# EasyEDA Pro project esp8266开关.eprj, board 1.0
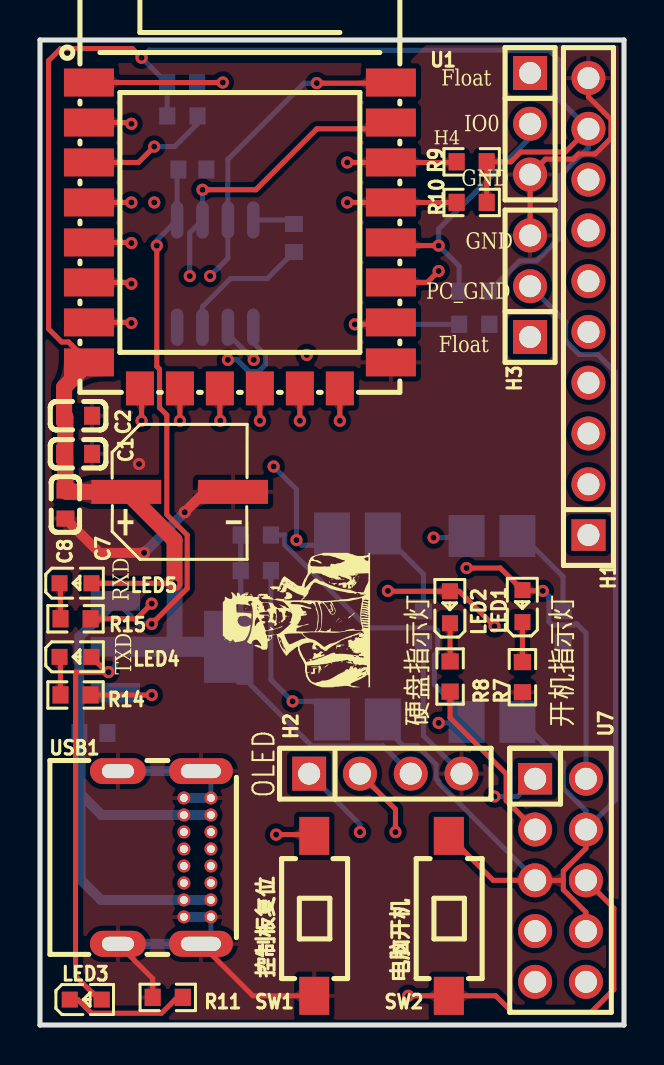
[diagram p4: board, top side]
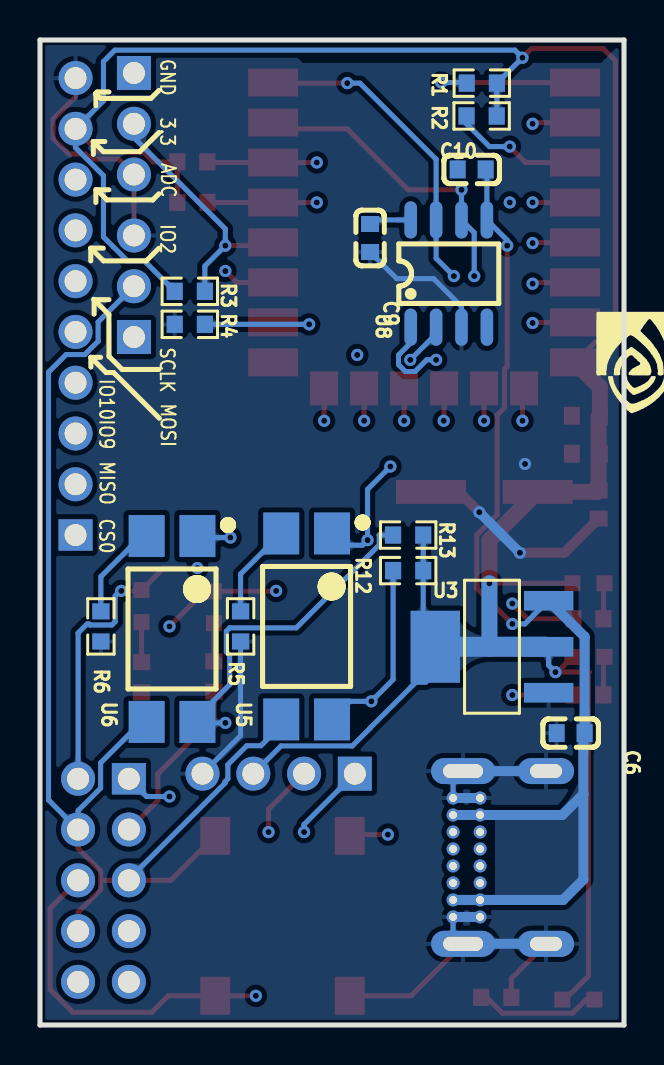
[diagram p5: board, bottom side, seen from below]

Outline 29.21 x 49.28 mm; copper layers: Top Layer, Inner1, Inner2, Bottom Layer. Coordinates in mm from the lower left corner of the outline.
Outline path: 0,49.28 29.21,49.28 29.21,0 0,0 0,49.28
Stack: Top Layer 0.035mm / Dielectric1 1.51mm FR4 er 4.5 / Inner1 0.035mm / Dielectric2 0.48mm PP er 4.5 / Inner2 0.035mm / Dielectric3 0.48mm PP er 4.5 / Bottom Layer 0.035mm

## Design rules (mm)
template: JLCPCB Capability(Two Layers Board)
spacing copperThickness1oz (default): track to track 0.102, other pairs 0.152 to 0.3
spacing copperThickness2oz: track to track 0.203, other pairs 0.152 to 0.3
track width copperThickness1oz (default): min 0.127, default 0.254, max 2.54
track width copperThickness2oz: min 0.203, default 0.254, max 2.54
differential pair differentialPair (default): width min 0.127, default 0.254, max 2.54; gap min 0.152, default 0.152
via viaSize (default): diameter min 0.5, default 0.61, max 10; hole min 0.3, default 0.305, max 6.3

## Placement (name value [footprint] x y rotation side)
C1  100nF  [C0603]  1.91 28.58 180 top
C2  10uF  [C0603]  1.91 30.48 180 top
C6  100nF  [C0603]  2.67 14.61 180 bottom
C7  220uF  [CAP-SMD_BD6.3-L6.6-W6.6-FD]  6.99 26.67 0 top
C8  100nF  [C0603]  1.27 26.03 90 top
C9  100nF  [C0603]  12.7 39.37 90 bottom
C10  100nF  [C0603]  7.62 42.8 180 bottom
H1  其他  [HDR-TH_10P-P2.54-V-F]  27.43 35.94 90 top
H2  OLED  [HDR-TH_4P-P2.54-V-F]  17.27 12.57 0 top
H3  PZ254V-11-03P  [HDR-TH_3P-P2.54-V-M]  24.51 36.96 90 top
H4  PZ254V-11-03P  [HDR-TH_3P-P2.54-V-M]  24.51 45.08 270 top
LED1  MHT192WDT-ICE  [LED0603-RD]  24.13 20.95 90 top
LED2  MHT192WDT-ICE  [LED0603-RD]  20.51 20.9 90 top
LED3  MHT192WDT-ICE  [LED0603-RD]  2.29 1.27 0 top
LED4  MHT192WDT-ICE  [LED0603-RD]  1.78 18.42 0 top
LED5  MHT192WDT-ICE  [LED0603-RD]  1.78 22.1 0 top
R1  10kΩ  [R0603]  7.11 47.12 0 bottom
R2  10kΩ  [R0603]  7.12 45.47 0 bottom
R3  10kΩ  [R0603]  21.72 36.7 0 bottom
R4  10kΩ  [R0603]  21.72 35.05 0 bottom
R5  50Ω  [R0603]  19.18 19.94 90 bottom
R6  50Ω  [R0603]  26.16 19.94 90 bottom
R7  550Ω  [R0603]  24.13 17.4 90 top
R8  550Ω  [R0603]  20.51 17.43 90 top
R9  4.7kΩ  [R0603]  21.59 43.18 0 top
R10  4.7kΩ  [R0603]  21.59 41.15 0 top
R11  550Ω  [R0603]  6.39 1.38 0 top
R12  10kΩ  [R0603]  10.79 22.73 180 bottom
R13  10kΩ  [R0603]  10.79 24.51 180 bottom
R14  550Ω  [R0603]  1.78 16.51 180 top
R15  550Ω  [R0603]  1.78 20.32 180 top
SW1  TS-1101-C-W  [SW-SMD_L6.0-W3.3-LS8.0]  13.72 5.46 90 top
SW2  TS-1101-C-W  [SW-SMD_L6.0-W3.3-LS8.0]  20.45 5.46 90 top
U1  2.4GHz  [WIFIM-SMD_ESP-12F-ESP8266MOD]  10 39.5 270 top
U3  AMS1117-3.3  [SOT-223-4_L6.5-W3.5-P2.30-LS7.0-BR]  6.6 18.92 180 bottom
U5  PS2501-S  [SMD-4_L5.5-W4.5-P2.54-LS10.0-TL]  15.88 19.94 270 bottom
U6  PS2501-S  [SMD-4_L5.5-W4.5-P2.54-LS10.0-TL]  22.61 19.81 270 bottom
U7  PM254-2-05-Z-8.5  [HDR-TH_10P-P2.54-V-F-R2-C5-S2.54]  26.03 7.24 270 top
U8  CH340N  [SOP-8_L4.9-W3.9-P1.27-LS6.0-BL]  8.76 37.59 180 bottom
USB1  TYPEC-306DDW-ARP16  [USB-C-TH_TYPEC-306DDW-ARP16]  6.22 8.38 270 top

## Footprints (pads in the part's own frame, mm; a bottom-side part is the same pattern mirrored in y, then rotated)
C0603
  rect 0.8x0.9 smd: 1(-0.7,0) 2(0.7,0)
CAP-SMD_BD6.3-L6.6-W6.6-FD
  rect 3.5x1.2 smd: 1(-2.67,0) 2(2.67,0)
HDR-TH_3P-P2.54-V-M
  rect 1.7x1.7 hole 1.1: 1(-2.54,0)
  round 1.7 hole 1.1: 2(0,0) 3(2.54,0)
HDR-TH_4P-P2.54-V-F
  rect 1.7x1.7 hole 1.1: 1(-3.81,0)
  round 1.7 hole 1.1: 2(-1.27,0) 3(1.27,0) 4(3.81,0)
HDR-TH_10P-P2.54-V-F
  rect 1.575x1.7 hole 1.1: 1(-11.43,0)
  round 1.7 hole 1.1: 2(-8.89,0) 3(-6.35,0) 4(-3.81,0) 5(-1.27,0) 6(1.27,0) 7(3.81,0) 8(6.35,0) 9(8.89,0) 10(11.43,0)
HDR-TH_10P-P2.54-V-F-R2-C5-S2.54
  rect 1.575x1.7 hole 1.1: 1(-5.08,-1.27)
  round 1.7 hole 1.1: 2(-5.08,1.27) 3(-2.54,-1.27) 4(-2.54,1.27) 5(0,-1.27) 6(0,1.27) 7(2.54,-1.27) 8(2.54,1.27) 9(5.08,-1.27) 10(5.08,1.27)
LED0603-RD
  rect 0.8x0.8 smd: 1(-0.799,0) 2(0.799,0)
R0603
  rect 0.806x0.864 smd: 1(-0.753,0) 2(0.753,0)
SMD-4_L5.5-W4.5-P2.54-LS10.0-TL
  rect 2.1x1.8 smd: 1(-4.65,1.27) 2(-4.65,-1.27) 3(4.65,-1.27) 4(4.65,1.27)
SOP-8_L4.9-W3.9-P1.27-LS6.0-BL
  oval 0.63x1.865 smd: 1(-1.905,-2.683) 2(-0.635,-2.683) 3(0.635,-2.683) 4(1.905,-2.683) 5(1.905,2.683) 6(0.635,2.683) 7(-0.635,2.683) 8(-1.905,2.683)
SOT-223-4_L6.5-W3.5-P2.30-LS7.0-BR
  rect 2.47x0.98 smd: 1(2.835,-2.3) 2(2.835,0) 3(2.835,2.3)
  rect 2.47x3.6 smd: 4(-2.835,0)
SW-SMD_L6.0-W3.3-LS8.0
  rect 1.9x1.5 smd: 1(-4,0) 2(4,0)
USB-C-TH_TYPEC-306DDW-ARP16
  oval 1.3x3.2 hole 0.7x2: 17(4.32,1.825) 20(-4.32,1.825)
  oval 1.3x2.8 hole 0.7x1.6: 18(4.32,-2.325) 19(-4.32,-2.325)
  round 0.65 hole 0.4: A1(-2.975,2.325) A4(-2.125,2.325) A5(-1.275,2.325) A6(-0.425,2.325) A7(0.425,2.325) A8(1.275,2.325) A9(2.125,2.325) A12(2.975,2.325) B1(2.975,0.975) B4(2.125,0.975) B5(1.275,0.975) B6(0.425,0.975) B7(-0.425,0.975) B8(-1.275,0.975) B9(-2.125,0.975) B12(-2.975,0.975)
WIFIM-SMD_ESP-12F-ESP8266MOD
  rect 1.4x2.5 smd: 1(-7.651,-7.551) 2(-5.651,-7.551) 3(-3.651,-7.551) 4(-1.651,-7.551) 5(0.349,-7.551) 6(2.349,-7.551) 7(4.349,-7.551) 8(6.349,-7.551) 9(6.349,7.548) 10(4.349,7.55) 11(2.349,7.551) 12(0.349,7.551) 13(-1.651,7.55) 14(-3.651,7.551) 15(-5.651,7.551) 16(-7.651,7.551)
  rect 1.7x1.4 smd: 17(7.651,-5) 18(7.649,-3.002) 19(7.649,-1.004) 20(7.649,0.998) 21(7.649,2.997) 22(7.651,4.997)

## Nets
As in the schematic.

Pads without a net: H3 1; H4 1; U7 9 10; U8 4; USB1 A5 A8 B5 B8

## Via types
v1: diameter 0.61, hole 0.305, Top Layer to Bottom Layer, 50 vias

## Routing (per net, layer and track width the routed paths; a pad name or vN(x,y) marks a point on that pad's centre or on a via; arc(x,y) is an arc through that point)
+3.3V: length 134.6
  Top Layer w0.254: 3.09,1.14 1.78,2.45 1.78,17.62 1.74,17.65 3.34,17.65 ; 3.34,17.65 LED4.2 ; 3.34,17.65 v1(3.43,17.65) ; H1.9 26.28,43.67 24.04,43.67 23.55,43.18 R9.2 R10.2 ; LED5.2 v1(6.73,22.1) ; v1(5.08,48.39) 4.62,48.85 1.04,48.85 0.43,48.24 0.43,34.82 1.08,34.17 1.43,34.17 U1.8
  Top Layer w0.8: U1.8 1.21,31.9 C2.2 1.27,30.42 C8.2 1.34,26.67 C7.1 6.73,24.25 v1(6.73,22.1)
  Bottom Layer w0.254: U3.2 3.77,17.99 v1(3.43,17.65) ; 9.91,17.14 10.41,17.14 12.7,14.86 12.7,14.85 13.59,13.96 17.16,13.96 H2.3 ; U3.4 10.04,19.53 R12.2 R13.2 ; R3.2 23.99,38.23 24.84,38.23 26.03,39.42 26.03,42.49 27.43,43.89 H1.9 26.03,46.23 26.03,48.2 25.46,48.77 5.46,48.77 v1(5.08,48.39) 6.35,47.12 R1.1 6.36,45.48 R2.1
  Bottom Layer w0.8: v1(6.73,22.1) 6.73,18.99 6.67,18.92
  Bottom Layer w1: U3.4 3.9,18.92
GND: length 60.8
  Top Layer w0.254: H1.10 27.43,46.43 28.56,45.3 28.56,44.36 27.77,43.57 26.94,43.57 26.68,43.32 25.28,43.32 H4.3 H3.3 ; SW1.1 10.65,1.46 USB1.17 ; 5.64,1.13 5.64,2.32 USB1.18 ; 18.16,33.15 U1.9
  Top Layer w0.5: v1(7.24,25.65) 8.25,26.67 C7.2 ; C8.1 2.98,23.62 v1(5.21,23.62)
  Bottom Layer w0.254: USB1.A1 8.55,12.2 USB1.20 ; USB1.17 8.55,4.56 USB1.A12 ; C9.1 11.37,37.34 9.53,37.34 8.13,35.94 U8.3 ; R5.1 19.18,14.48 H2.4
  Bottom Layer w0.5: USB1.B12 USB1.A1 ; USB1.A12 7.32,5.41 ; USB1.19 USB1.20 ; v1(5.21,23.62) v1(7.24,25.65) ; USB1.17 USB1.18
  vias: v1(4.95,28.07)
VCC: length 55.4
  Top Layer w0.254: v1(5.84,38.99) 5.84,32.95 5.98,32.81 5.98,30.88 6.34,30.52 6.34,25.53 7.36,24.51 7.36,21.84 v1(5.59,20.07)
  Bottom Layer w0.254: U3.3 4.02,20.97 4.05,20.97 4.95,20.07 v1(5.59,20.07) ; v1(5.84,38.99) 5.84,39.26 U8.5 6.86,42.74 C10.2
  Bottom Layer w0.5: 2.03,11.56 3.08,10.51 USB1.B9 USB1.A4 ; 2.03,11.56 2.03,7.27 3.05,6.26 USB1.B4 USB1.A9 ; 2.03,11.56 2.03,14.54 C6.2 1.97,19.42 U3.3
ADC: length 26.2
  Top Layer w0.254: U1.2 4.51,45.15 v1(4.57,45.08)
  Inner1 w0.254: H1.8 26.03,43.69 23.75,43.69 22.91,44.53 5.13,44.53 v1(4.57,45.08)
CS0: length 26.4
  Top Layer w0.254: U1.17 5.08,31.77 v1(5.08,30.23)
  Inner1 w0.254: v1(5.08,30.23) 5.08,30.17 8.05,27.2 23.6,27.2 26.29,24.51 H1.1
D+: length 31.4
  Inner2 w0.254: v1(9.4,33.27) 9.4,30.67 9.93,30.14 9.93,10.18 8.8,9.05 8.79,9.05 USB1.A6 8.3,8.56 8.3,8.56 7.94,8.21 7.94,8.2 7.7,7.96 7.2,7.96
  Bottom Layer w0.254: v1(9.4,33.27) 9.87,33.27 10.45,32.69 10.93,32.69 11.28,33.03 11.28,33.52 10.67,34.12 U8.1
D-: length 30.8
  Inner1 w0.254: 8.55,7.96 8.3,8.2 8.3,8.2 7.94,8.56 7.94,8.56 7.7,8.81 USB1.B7
  Inner2 w0.254: 8.55,7.96 8.79,8.2 8.8,8.2 11.3,10.71 11.3,12.06 10.41,12.95 10.41,30.47 10.69,30.75 v1(10.69,33.27)
  Bottom Layer w0.254: v1(10.69,33.27) 9.4,34.57 U8.2
ESP_RST: length 49
  Top Layer w0.254: U1.1 v1(9.14,47.15) ; v1(11.81,9.53) 13.65,9.53 SW1.2
  Inner2 w0.254: v1(11.81,9.53) 11.81,27.24 12.27,27.7 12.27,44.02 v1(9.14,47.15)
  Bottom Layer w0.254: v1(9.14,47.15) 7.9,47.15 R1.2
ESP_RXD: length 36.2
  Top Layer w0.254: v1(8.13,41.78) 10.79,41.78 13.84,44.83 17.23,44.83 U1.15 ; v1(5.59,21.08) 4.83,20.32 R15.1
  Inner2 w0.254: v1(7.49,37.47) 7.49,30.56 7.58,30.47 7.58,26.14 7.82,25.9 7.82,25.41 6.15,23.74 6.15,21.64 v1(5.59,21.08)
  Bottom Layer w0.254: v1(8.13,41.78) U8.6 7.49,39.64 v1(7.49,37.47)
ESP_TXD: length 41.2
  Top Layer w0.254: R14.1 v1(5.59,16.51) ; U1.16 17.52,47.12 v1(13.84,47.12)
  Inner2 w0.254: v1(8.51,37.47) 8.51,30.54 8.43,30.47 8.43,29.98 8.51,29.91 8.51,19.43 v1(5.59,16.51)
  Bottom Layer w0.254: v1(8.51,37.47) 9.4,38.35 U8.7 9.4,43.31 13.21,47.12 v1(13.84,47.12)
HDD_LED+: length 45.3
  Top Layer w0.254: v1(22.73,19.94) 20.97,21.7 LED2.2 17.42,21.7 v1(17.4,21.72) ; v1(4.57,39.12) 4.54,39.15 U1.5
  Inner1 w0.254: v1(17.4,21.72) 12.32,21.72 10.79,23.24 10.74,23.24 3.99,29.99 3.99,37.33 4.57,37.91 v1(4.57,39.12) ; v1(22.73,11.43) v1(22.73,19.94)
  Bottom Layer w0.254: v1(22.73,11.43) 23.88,11.43 U7.1
HDD_LED-: length 8.7
  Top Layer w0.254: U7.3 23.32,11.23 23.32,12.56 20.51,15.37 R8.1
IO0: length 13.2
  Top Layer w0.254: v1(19.94,38.99) 17.71,38.99 U1.12
  Bottom Layer w0.254: H4.2 24.38,44.96 24.38,44.27 19.94,39.82 v1(19.94,38.99) 20.96,37.96 R3.1
IO2: length 11
  Top Layer w0.254: U1.11 19.37,37.15 v1(19.94,37.72)
  Inner1 w0.254: v1(19.94,37.72) 23.68,37.72 24.04,38.09 24.88,38.09 26.54,39.75 H1.7
IO9: length 21.4
  Top Layer w0.254: v1(9.02,30.23) 9,30.25 U1.19
  Inner1 w0.254: H1.3 26.8,30.23 26.03,30.23 24.73,28.93 11.47,28.93 10.17,30.23 v1(9.02,30.23)
IO10: length 19.6
  Top Layer w0.254: U1.20 v1(11,30.23)
  Inner1 w0.254: v1(11,30.23) 12.17,30.23 13.11,29.29 22.55,29.29 23.49,30.23 25.53,30.23 H1.4
MISO: length 26.3
  Top Layer w0.254: U1.18 v1(7,30.23)
  Inner1 w0.254: v1(7,30.23) 8.19,30.23 9.84,28.57 16.09,28.57 16.27,28.39 16.27,27.81 16.45,27.63 17.62,27.63 17.79,27.81 17.79,28.39 17.97,28.57 19.14,28.57 19.32,28.39 19.32,27.81 19.5,27.63 20.66,27.63 20.84,27.81 20.84,28.39 21.02,28.57 25.91,28.57 H1.2
MOSI: length 18.4
  Top Layer w0.254: U1.21 v1(13,30.23)
  Inner1 w0.254: H1.5 22.99,30.23 22.92,30.23 22.33,29.64 14.75,29.64 14.17,30.23 v1(13,30.23)
P_LED+: length 45.8
  Top Layer w0.254: v1(21.34,22.86) 23.02,22.86 LED1.2 24.17,21.72 v1(25.15,21.72) ; U1.4 v1(4.57,41.15)
  Inner1 w0.254: v1(5.72,41.15) v1(13.34,33.52)
  Inner2 w0.254: v1(4.57,41.15) v1(5.72,41.15) ; v1(13.34,33.52) 13.82,33.05 13.82,32.23 15.58,30.47 15.58,24.55 17.27,22.86 v1(21.34,22.86)
  Bottom Layer w0.254: U7.2 27.31,19.61 26.85,20.06 26.76,20.06 26.71,20.01 25.61,20.01 25.45,20.17 25.45,21.46 25.2,21.72 v1(25.15,21.72)
PC_GND: length 61.1
  Top Layer w0.254: U7.8 27.31,5.64 26.18,6.77 26.18,7.71 27.31,8.84 U7.4 ; SW2.2 22.67,7.24 U7.5 26.18,7.24
  Bottom Layer w0.254: 24.13,15.16 26.18,13.12 26.18,11.85 27.31,10.72 U7.4 28.78,11.26 28.78,32.66 27.9,33.54 26.96,33.54 26.3,34.2 26.3,35.17 H3.2 ; U7.5 24.76,7.29 19.95,12.11 19.95,12.18 19.81,12.32 19.81,13.03 18.87,13.97 18.16,13.97 17.27,14.86 17.27,15.16 U5.3
PC_PWR: length 22.6
  Top Layer w0.254: v1(4.57,37.08) 4.51,37.15 U1.6
  Inner1 w0.254: v1(4.57,37.08) 5.97,35.69 5.97,30.35 8.38,27.94 v1(11.68,27.94)
  Bottom Layer w0.254: v1(11.68,27.94) 12.83,26.8 v1(12.83,24.26) 13.08,24 14.27,24 14.6,24.33 U5.1
PC_RST: length 26.7
  Top Layer w0.254: U1.7 4.54,35.15 v1(4.57,35.12)
  Inner1 w0.254: v1(4.57,35.12) 4.57,30.54 4.5,30.47 4.5,29.98 8.52,25.96 18.11,25.96 v1(19.69,24.38)
  Bottom Layer w0.254: 21.59,24.46 21.51,24.38 v1(19.69,24.38)
POWER_SW+: length 45.4
  Top Layer w0.254: v1(18.41,1.46) SW2.1 22.8,1.46 23.62,0.63 27.56,0.63 28.7,1.78 28.7,5.84 U7.6
  Inner1 w0.254: v1(18.41,1.46) 10.41,9.46 10.41,13.97 v1(12.64,16.19)
  Bottom Layer w0.254: U5.4 13.7,16.19 v1(12.64,16.19) 11.55,17.28 R12.1
RST_SW+: length 30.1
  Inner1 w0.254: U7.7 19.94,9.53 v1(19.94,15.11)
  Bottom Layer w0.254: R13.1 12.24,24.51 12.24,24.51 12.24,24.02 16.39,19.87 19.72,19.87 19.89,19.7 19.89,18.67 19.72,18.5 19.72,17.03 21.59,15.16 21.54,15.11 v1(19.94,15.11)
SCL: length 44.9
  Top Layer w0.254: R10.1 U1.13 v1(15.37,41.15) ; H2.2 17.78,10.8 v1(17.78,9.65)
  Inner2 w0.254: H2.2 15.37,13.21 15.37,14.29 23.57,22.49 23.57,23.8 15.16,32.2 15.16,35.29 15.37,35.5 v1(15.37,41.15)
SCLK: length 24.4
  Top Layer w0.254: U1.22 v1(15,30.23)
  Inner1 w0.254: v1(15,30.23) 15.66,30.23 15.84,30.41 15.84,31.82 16.02,32 17.18,32 17.36,31.82 17.36,30.41 17.54,30.23 18.71,30.23 18.89,30.41 18.89,31.82 19.07,32 20.23,32 20.41,31.82 20.41,30.41 20.59,30.23 22.41,30.23 25.64,33.45 25.64,35.42 H1.6
SDA: length 41.7
  Top Layer w0.254: R9.1 20.8,43.15 U1.14 v1(15.37,43.15)
  Inner2 w0.254: v1(15.37,43.15) 12.76,40.54 12.76,33.28 13.1,32.94 13.42,32.94 13.46,32.9 13.46,30.59 13.58,30.47 13.58,29.98 13.46,29.87 H2.1
  Bottom Layer w0.254: v1(16,9.65) 16,10.03 H2.1
$1N1038: length 6.6
  Top Layer w0.254: U1.3 4.92,43.15 v1(5.72,43.94)
  Bottom Layer w0.254: v1(5.72,43.94) 6.73,43.94 7.87,45.08 R2.2
$1N2615: length 7.1
  Top Layer w0.254: U1.10 17.45,35.05 v1(15.75,35.05)
  Bottom Layer w0.254: R4.1 v1(15.75,35.05)
$1N2807: length 4.7
  Bottom Layer w0.254: R5.2 19.18,22.56 U5.2
$1N2985: length 4.6
  Bottom Layer w0.254: 24.13,24.46 26.16,22.43 R6.2
$1N4126: length 2
  Top Layer w0.254: R7.2 LED1.1
$1N4358: length 1.9
  Top Layer w0.254: LED2.1 20.51,20.09 R8.2
$1N5824: length 6.3
  Top Layer w0.254: R11.2 7.03,1.27 6.75,1.27 6.08,0.59 2.57,0.59 1.89,1.27 LED3.1
$1N5984: length 2.1
  Bottom Layer w0.254: U8.8 12.5,40.27 C9.2
$1N6357: length 1.9
  Top Layer w0.254: LED4.1 1.02,18.37 R14.2
$1N6457: length 1.8
  Top Layer w0.254: LED5.1 1.02,22.05 R15.2

## Copper pours and planes (outline as drawn; the poured copper is in the pictures)
GND on Top Layer: 0,49.28 1.14,48.13 18.42,48.13 19.57,49.28 29.21,49.28 29.21,0 0,0
GND on Bottom Layer: 0,49.28 1.14,48.13 16.07,48.13 17.22,49.28 29.21,49.28 29.21,0 0,0
VCC on Bottom Layer: 2.13,10.51 6.45,10.51 6.45,6.26 3.05,6.26 2.03,7.27 2.03,10.6

Small or netless copper shapes (teardrops, artwork), in the pictures only: 113 on Top Layer, 88 on Bottom Layer, 28 on Inner1, 16 on Inner2

## Text on the board
Bottom Silkscreen Layer: ADC | MOSI | GND | 3.3 | IO2 | SCLK | MISO | IO10 | IO9 | CS0
Top Silkscreen Layer: OLED | PC_GND | Float | GND | IO0 | RXD | TXD | 控制板复位 | 电脑开机 | 硬盘指示灯 | 开机指示灯
